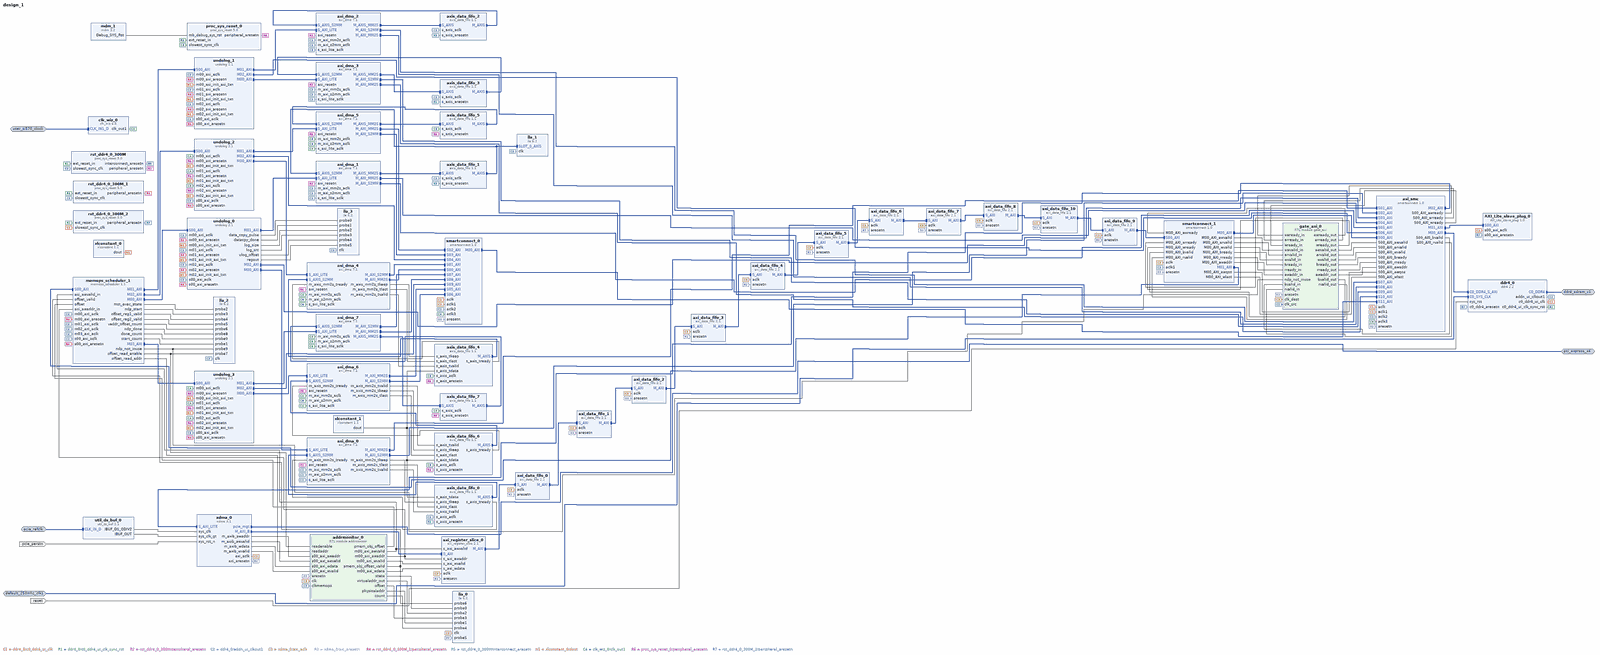
[diagram p0: block diagram of the top level, whole]
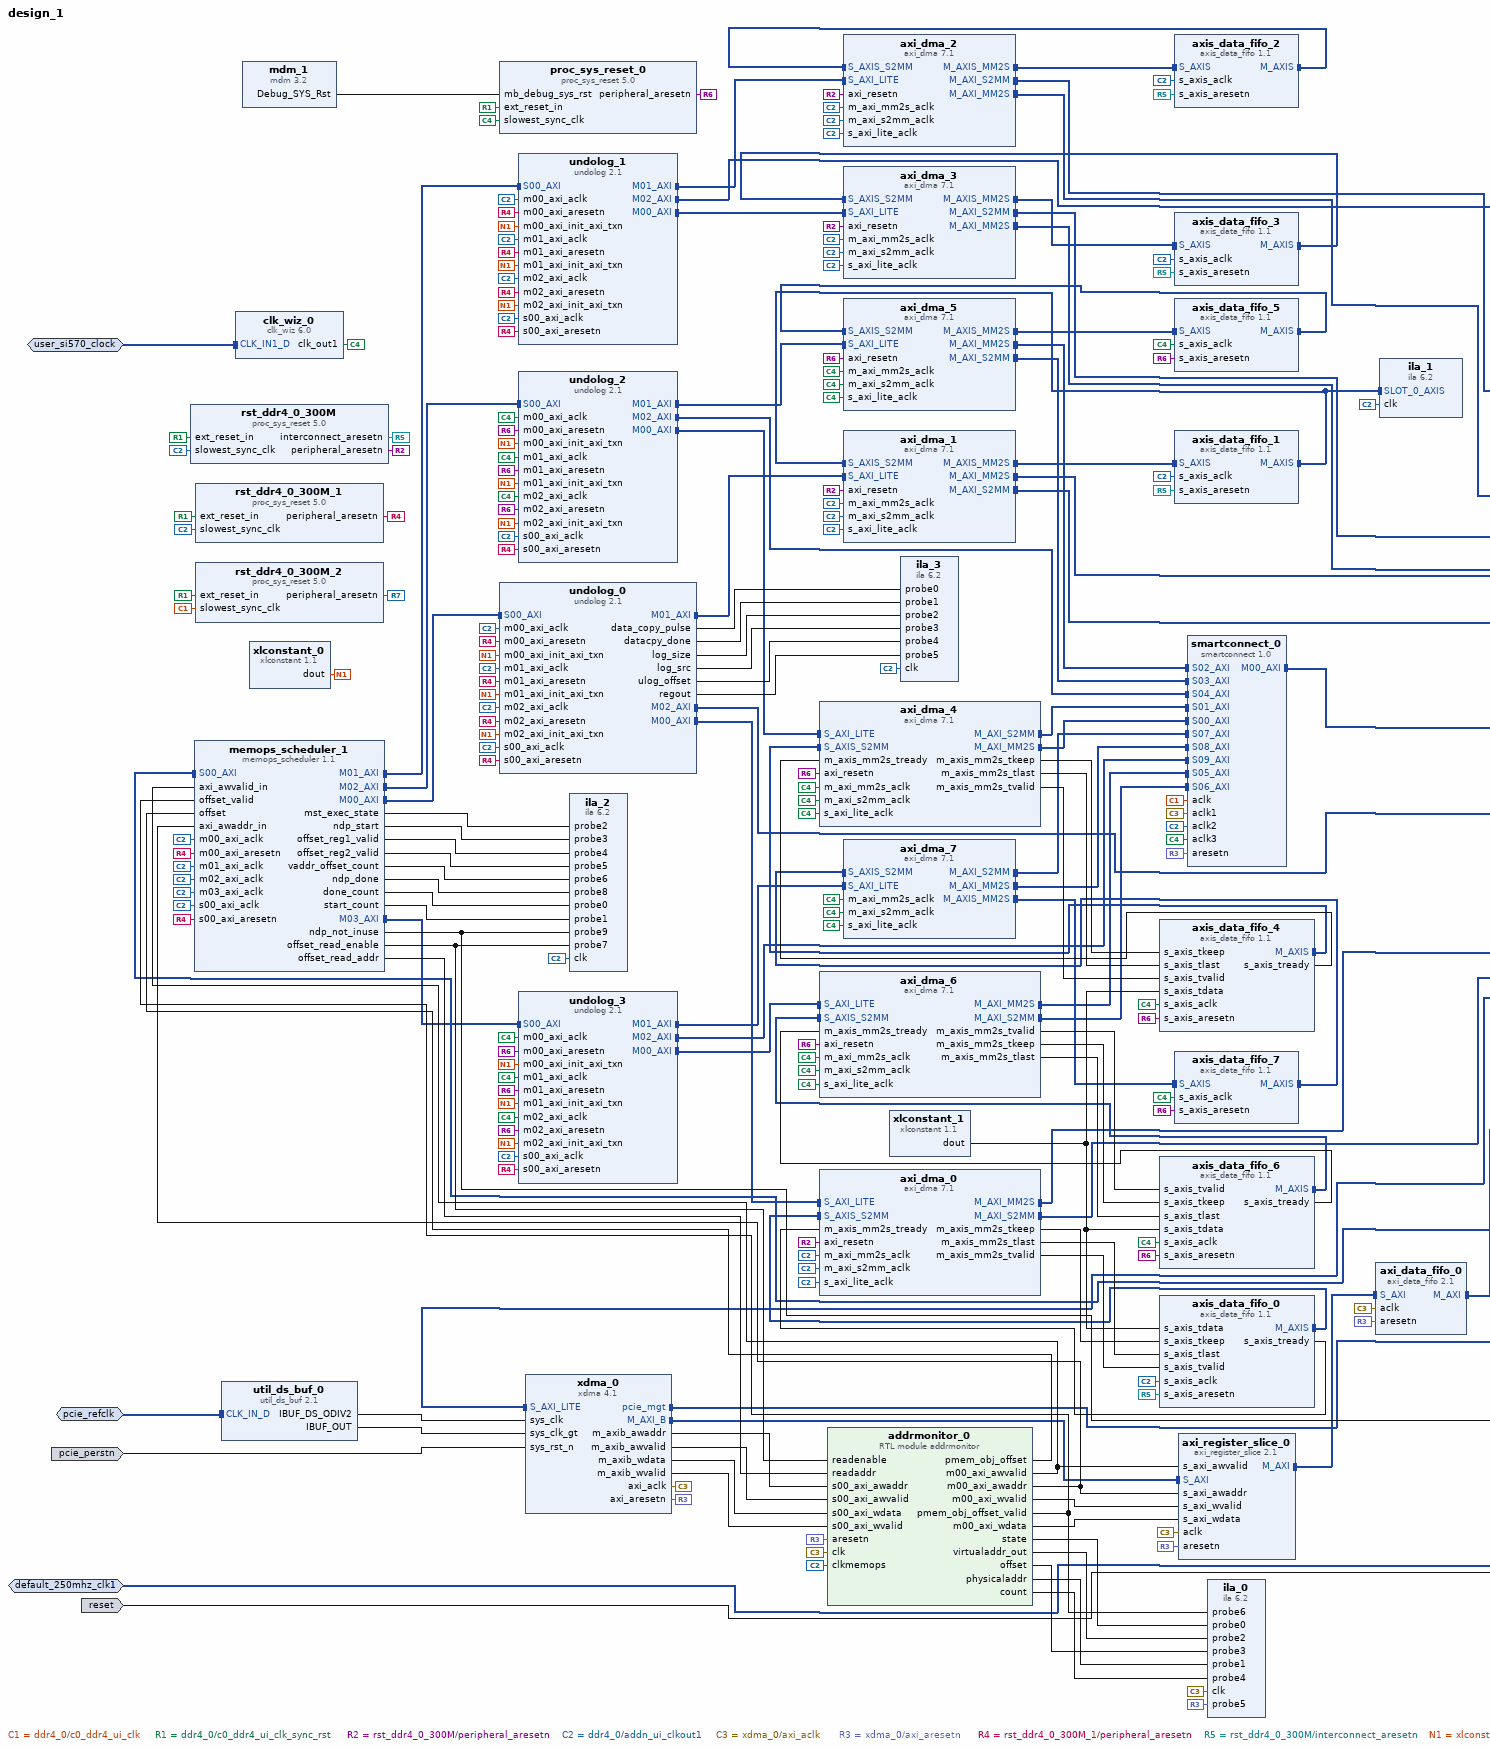
[diagram p1: block diagram of the top level, left part]
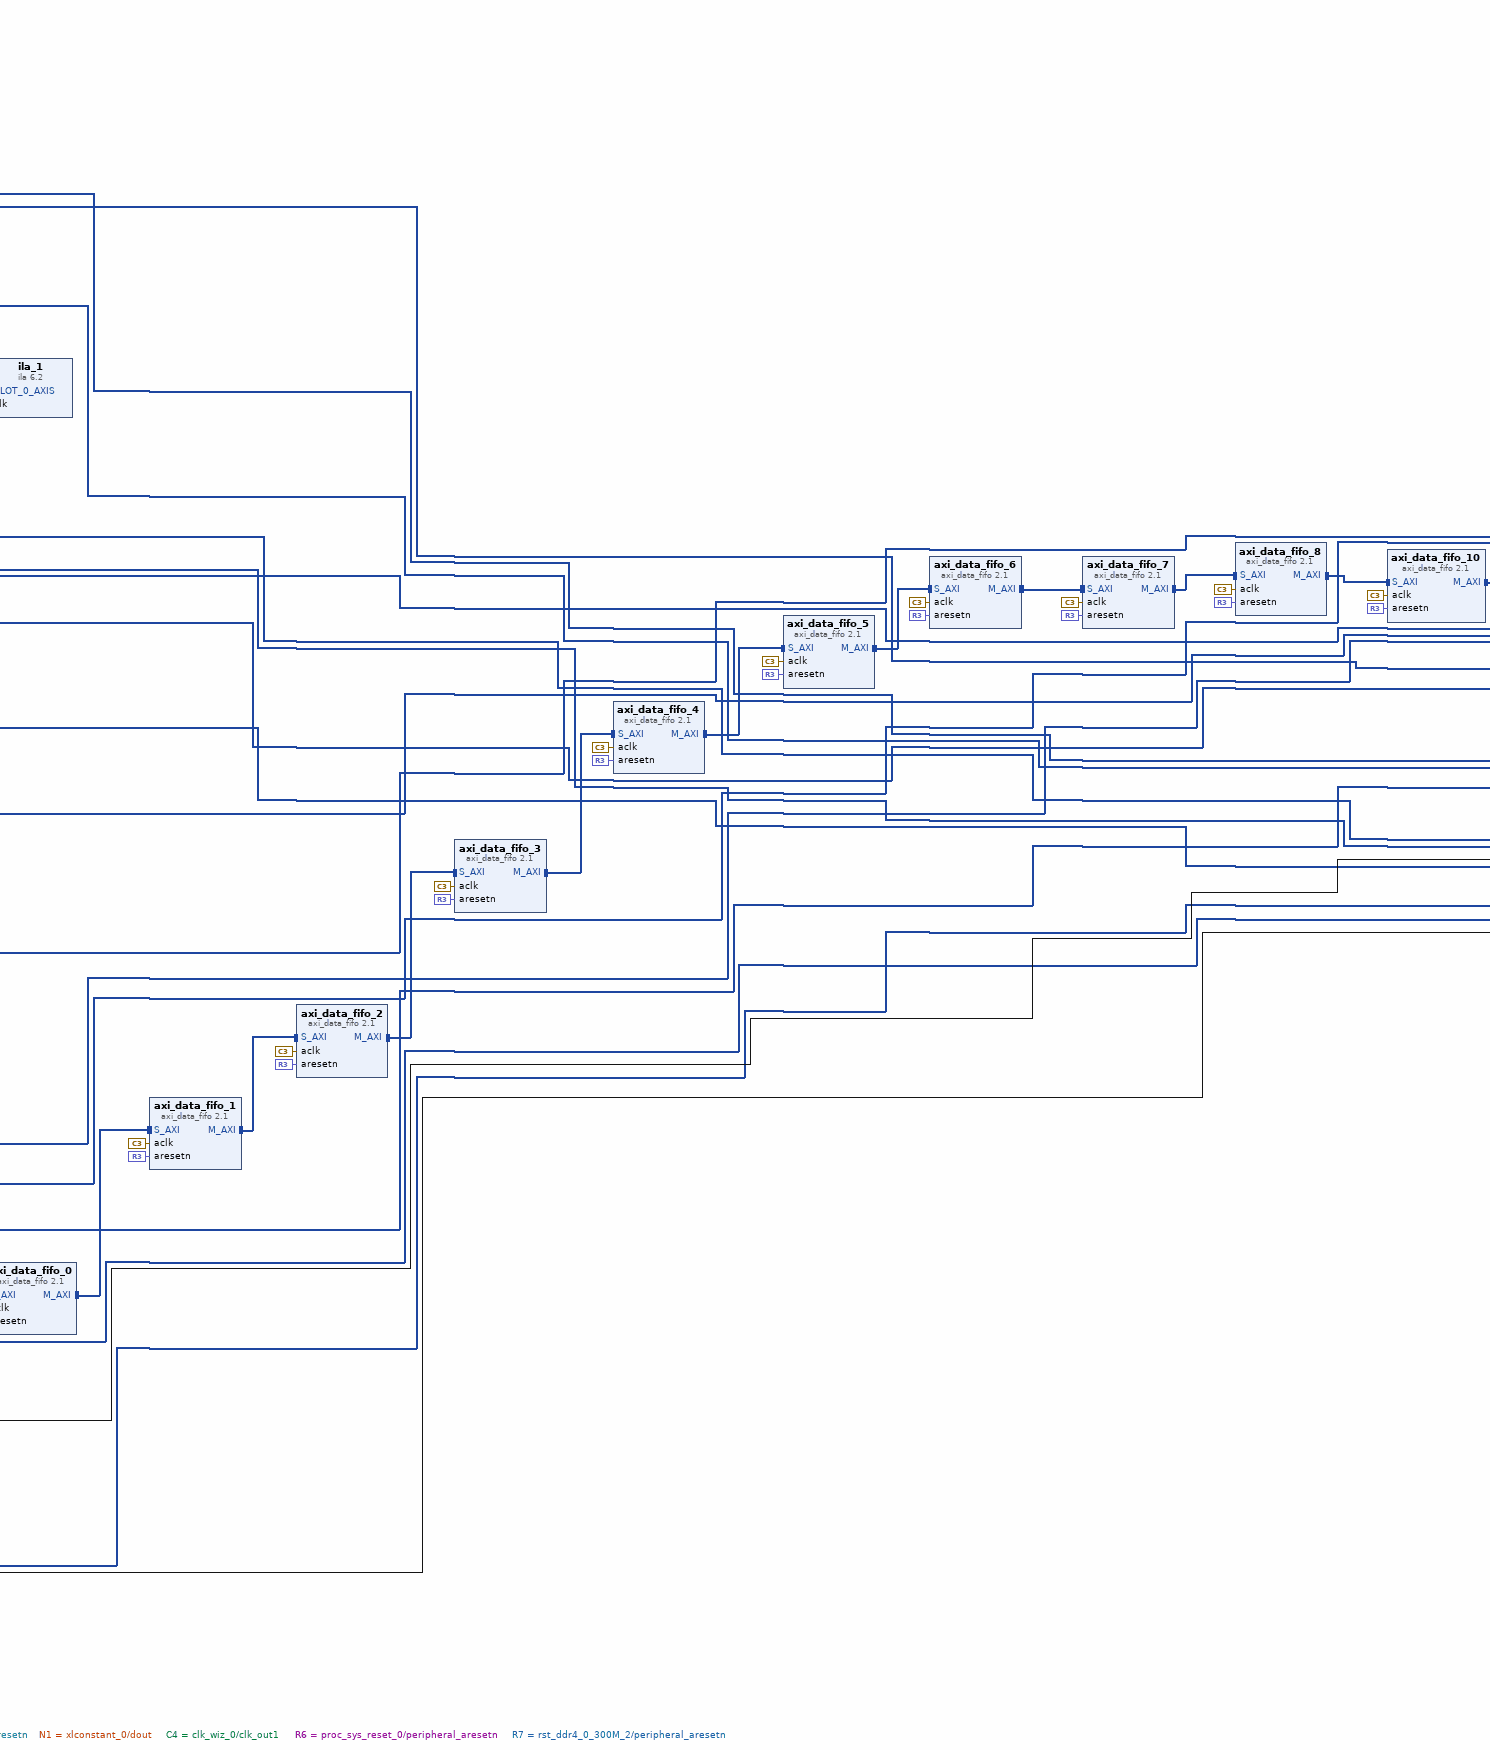
[diagram p2: block diagram of the top level, centre part]
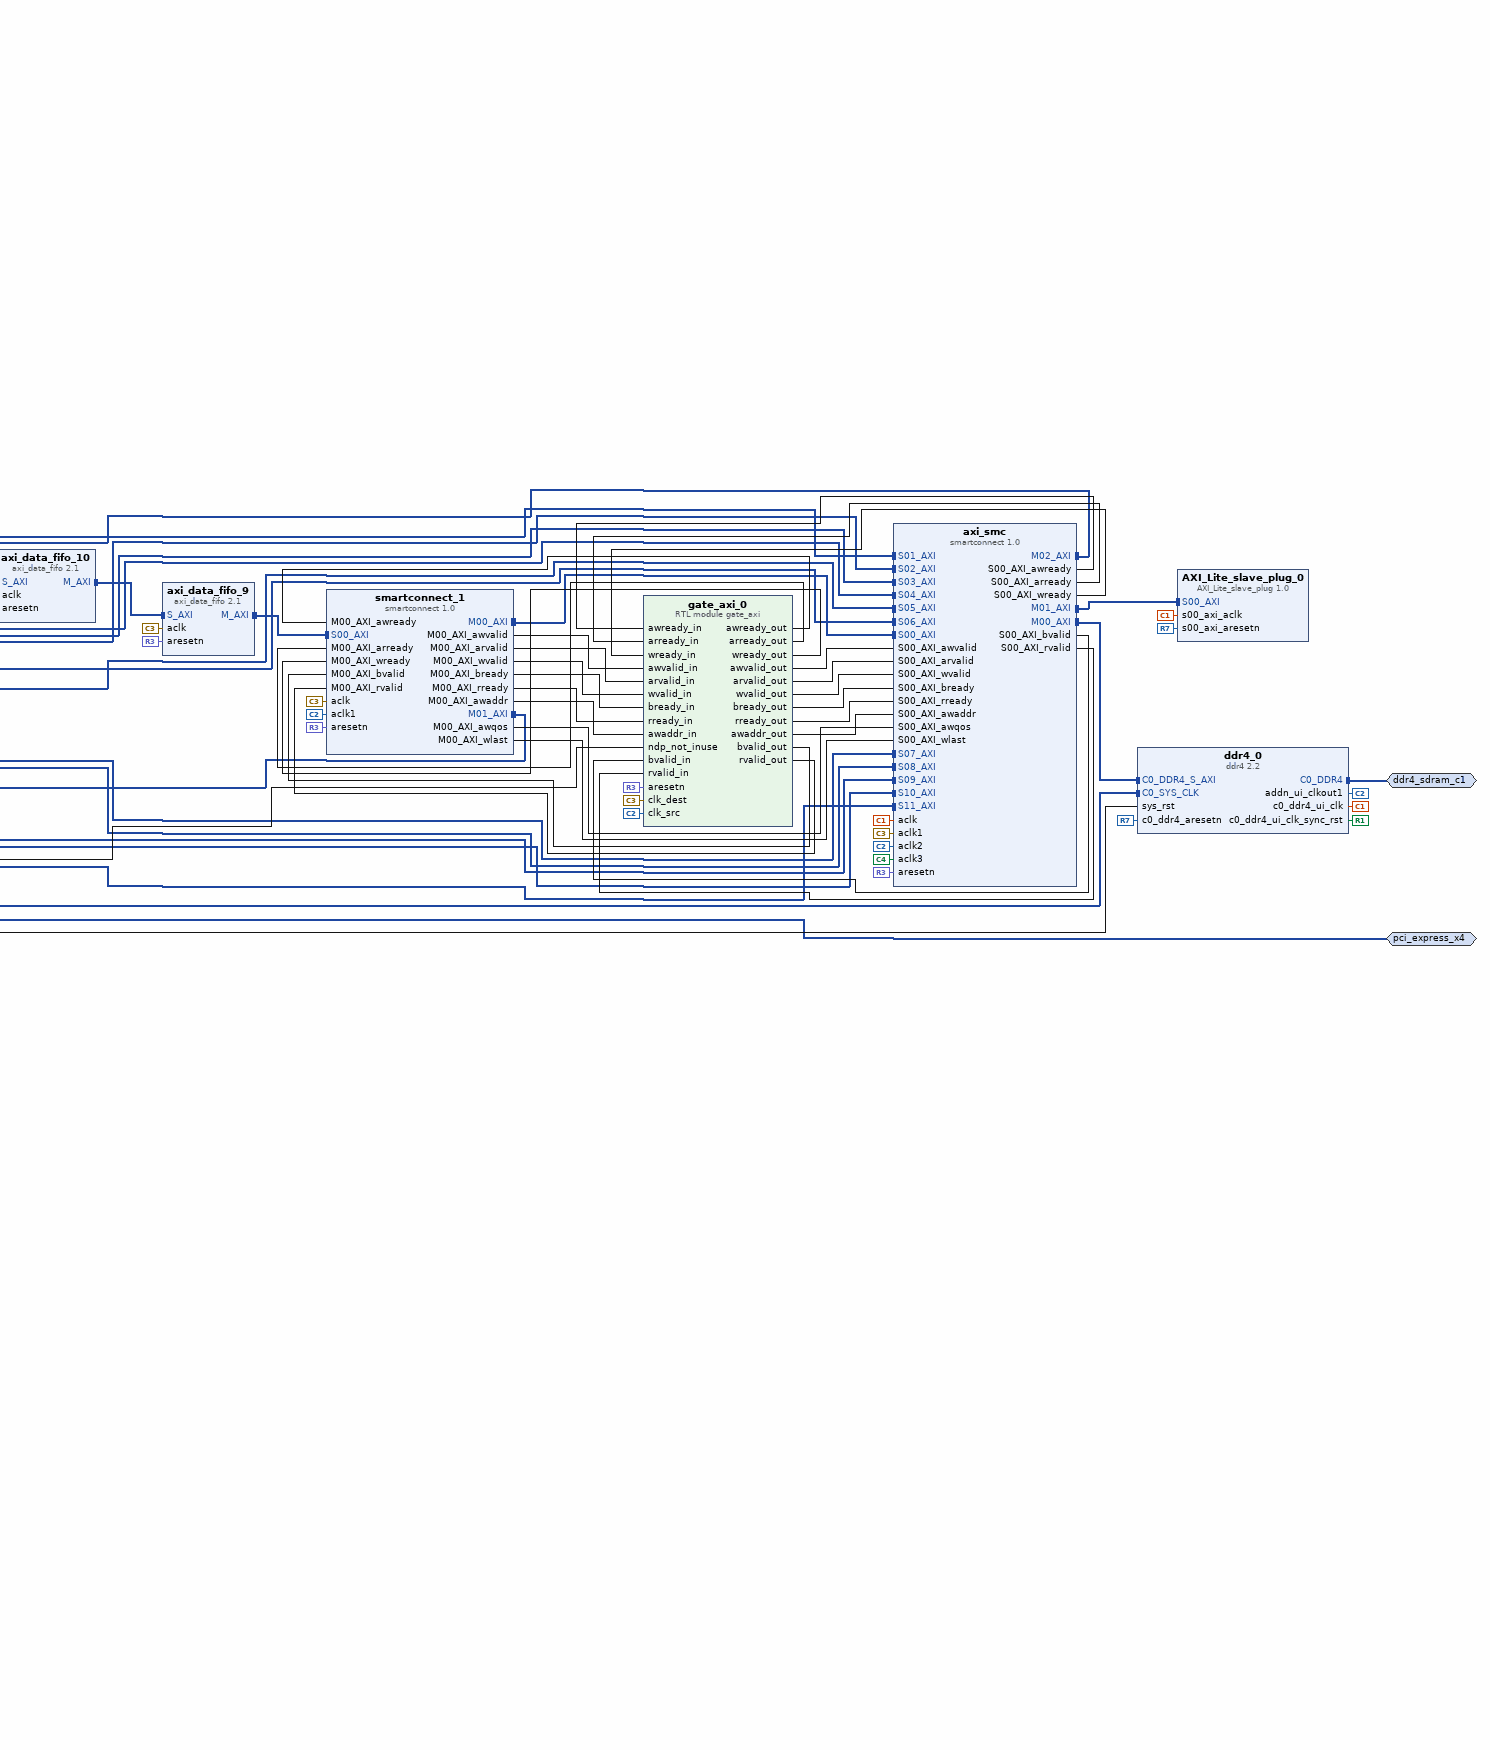
[diagram p3: block diagram of the top level, right part]
# Vivado block design design_1, xcvu9p-flga2104-2L-e, Vivado 2018.2
create_bd_design design_1

create_bd_intf_port -mode Master -vlnv xilinx.com:interface:ddr4_rtl:1.0 ddr4_sdram_c1
create_bd_intf_port -mode Slave -vlnv xilinx.com:interface:diff_clock_rtl:1.0 default_250mhz_clk1
set_property -dict {CONFIG.FREQ_HZ 250000000} [get_bd_intf_ports default_250mhz_clk1]
create_bd_intf_port -mode Master -vlnv xilinx.com:interface:pcie_7x_mgt_rtl:1.0 pci_express_x4
create_bd_intf_port -mode Slave -vlnv xilinx.com:interface:diff_clock_rtl:1.0 pcie_refclk
set_property -dict {CONFIG.FREQ_HZ 100000000} [get_bd_intf_ports pcie_refclk]
create_bd_intf_port -mode Slave -vlnv xilinx.com:interface:diff_clock_rtl:1.0 user_si570_clock
set_property -dict {CONFIG.FREQ_HZ 156250000} [get_bd_intf_ports user_si570_clock]
create_bd_port -dir I -type rst pcie_perstn
set_property -dict {CONFIG.POLARITY ACTIVE_LOW} [get_bd_ports pcie_perstn]
create_bd_port -dir I -type rst reset
set_property -dict {CONFIG.POLARITY ACTIVE_HIGH} [get_bd_ports reset]

create_bd_cell -type ip -vlnv xilinx.com:ip:ddr4:2.2 ddr4_0
set_property -dict [list \
  CONFIG.RESET_BOARD_INTERFACE reset \
  CONFIG.C0_CLOCK_BOARD_INTERFACE default_250mhz_clk1 \
  CONFIG.C0_DDR4_BOARD_INTERFACE ddr4_sdram_c1 \
  CONFIG.ADDN_UI_CLKOUT1_FREQ_HZ 250 \
  CONFIG.ADDN_UI_CLKOUT2_FREQ_HZ None \
] [get_bd_cells ddr4_0]
create_bd_cell -type ip -vlnv xilinx.com:ip:xdma:4.1 xdma_0
set_property -dict [list \
  CONFIG.functional_mode AXI_Bridge \
  CONFIG.pl_link_cap_max_link_speed 5.0_GT/s \
  CONFIG.axi_addr_width 32 \
  CONFIG.axisten_freq 250 \
  CONFIG.en_axi_slave_if false \
  CONFIG.pf0_device_id 9024 \
  CONFIG.SYS_RST_N_BOARD_INTERFACE pcie_perstn \
  CONFIG.PCIE_BOARD_INTERFACE pci_express_x4 \
  CONFIG.plltype QPLL1 \
  CONFIG.pf0_bar0_size 128 \
  CONFIG.pf0_bar0_64bit true \
  CONFIG.pf0_bar0_prefetchable true \
  CONFIG.pf0_bar2_enabled true \
  CONFIG.pf0_bar2_size 1 \
  CONFIG.pf0_bar2_scale Gigabytes \
  CONFIG.pf0_bar2_64bit true \
  CONFIG.pf0_bar2_prefetchable true \
  CONFIG.pciebar2axibar_0 0x44A10000 \
  CONFIG.pciebar2axibar_2 0x80000000 \
  CONFIG.PF0_DEVICE_ID_mqdma 9024 \
  CONFIG.PF2_DEVICE_ID_mqdma 9024 \
  CONFIG.PF3_DEVICE_ID_mqdma 9024 \
] [get_bd_cells xdma_0]
create_bd_cell -type ip -vlnv xilinx.com:ip:proc_sys_reset:5.0 rst_ddr4_0_300M
create_bd_cell -type ip -vlnv xilinx.com:ip:util_ds_buf:2.1 util_ds_buf_0
set_property -dict {CONFIG.USE_BOARD_FLOW true CONFIG.DIFF_CLK_IN_BOARD_INTERFACE pcie_refclk} [get_bd_cells util_ds_buf_0]
create_bd_cell -type ip -vlnv xilinx.com:ip:smartconnect:1.0 axi_smc
set_property -dict {CONFIG.NUM_MI 3 CONFIG.NUM_SI 15 CONFIG.NUM_CLKS 4} [get_bd_cells axi_smc]
create_bd_cell -type ip -vlnv xilinx.com:ip:proc_sys_reset:5.0 rst_ddr4_0_300M_1
create_bd_cell -type ip -vlnv xilinx.com:ip:axi_dma:7.1 axi_dma_0
set_property -dict {CONFIG.c_include_sg 0 CONFIG.c_sg_length_width 26} [get_bd_cells axi_dma_0]
create_bd_cell -type ip -vlnv xilinx.com:ip:axis_data_fifo:1.1 axis_data_fifo_0
create_bd_cell -type ip -vlnv xilinx.com:ip:proc_sys_reset:5.0 rst_ddr4_0_300M_2
create_bd_cell -type ip -vlnv xilinx.com:ip:xlconstant:1.1 xlconstant_0
create_bd_cell -type ip -vlnv xilinx.com:ip:axi_dma:7.1 axi_dma_1
set_property -dict {CONFIG.c_include_sg 0 CONFIG.c_sg_length_width 26} [get_bd_cells axi_dma_1]
create_bd_cell -type ip -vlnv xilinx.com:ip:axis_data_fifo:1.1 axis_data_fifo_1
create_bd_cell -type ip -vlnv xilinx.com:ip:xlconstant:1.1 xlconstant_1
set_property -dict {CONFIG.CONST_WIDTH 32 CONFIG.CONST_VAL 0} [get_bd_cells xlconstant_1]
create_bd_cell -type ip -vlnv xilinx.com:ip:axi_dma:7.1 axi_dma_2
set_property -dict {CONFIG.c_include_sg 0 CONFIG.c_sg_length_width 26} [get_bd_cells axi_dma_2]
create_bd_cell -type ip -vlnv xilinx.com:ip:axi_dma:7.1 axi_dma_3
set_property -dict {CONFIG.c_include_sg 0 CONFIG.c_sg_length_width 26} [get_bd_cells axi_dma_3]
create_bd_cell -type ip -vlnv xilinx.com:ip:axis_data_fifo:1.1 axis_data_fifo_2
create_bd_cell -type ip -vlnv xilinx.com:ip:axis_data_fifo:1.1 axis_data_fifo_3
create_bd_cell -type ip -vlnv xilinx.com:ip:smartconnect:1.0 smartconnect_0
set_property -dict {CONFIG.NUM_SI 10 CONFIG.NUM_CLKS 4} [get_bd_cells smartconnect_0]
create_bd_cell -type ip -vlnv xilinx.com:ip:axi_dma:7.1 axi_dma_4
set_property -dict {CONFIG.c_include_sg 0 CONFIG.c_sg_length_width 26} [get_bd_cells axi_dma_4]
create_bd_cell -type ip -vlnv xilinx.com:ip:axis_data_fifo:1.1 axis_data_fifo_4
create_bd_cell -type ip -vlnv xilinx.com:ip:axi_dma:7.1 axi_dma_5
set_property -dict {CONFIG.c_include_sg 0 CONFIG.c_sg_length_width 26} [get_bd_cells axi_dma_5]
create_bd_cell -type ip -vlnv xilinx.com:ip:axis_data_fifo:1.1 axis_data_fifo_5
create_bd_cell -type ip -vlnv xilinx.com:ip:axis_data_fifo:1.1 axis_data_fifo_6
create_bd_cell -type ip -vlnv xilinx.com:ip:axi_dma:7.1 axi_dma_6
set_property -dict {CONFIG.c_include_sg 0 CONFIG.c_sg_length_width 26} [get_bd_cells axi_dma_6]
create_bd_cell -type ip -vlnv xilinx.com:ip:axis_data_fifo:1.1 axis_data_fifo_7
create_bd_cell -type ip -vlnv xilinx.com:ip:axi_dma:7.1 axi_dma_7
set_property -dict {CONFIG.c_include_sg 0 CONFIG.c_sg_length_width 26} [get_bd_cells axi_dma_7]
create_bd_cell -type ip -vlnv xilinx.com:ip:clk_wiz:6.0 clk_wiz_0
set_property -dict [list \
  CONFIG.CLKOUT2_USED true \
  CONFIG.NUM_OUT_CLKS 2 \
  CONFIG.CLKOUT1_REQUESTED_OUT_FREQ 250 \
  CONFIG.CLKOUT1_REQUESTED_DUTY_CYCLE 50 \
  CONFIG.CLKOUT2_REQUESTED_OUT_FREQ 10 \
  CONFIG.MMCM_DIVCLK_DIVIDE 1 \
  CONFIG.MMCM_CLKFBOUT_MULT_F 8.000 \
  CONFIG.MMCM_CLKOUT0_DIVIDE_F 5.000 \
  CONFIG.MMCM_CLKOUT0_DUTY_CYCLE 0.500 \
  CONFIG.MMCM_CLKOUT1_DIVIDE 125 \
  CONFIG.USE_BOARD_FLOW true \
  CONFIG.CLK_IN1_BOARD_INTERFACE user_si570_clock \
  CONFIG.CLKOUT1_JITTER 90.547 \
  CONFIG.CLKOUT1_PHASE_ERROR 83.183 \
  CONFIG.CLKOUT2_JITTER 170.541 \
  CONFIG.CLKOUT2_PHASE_ERROR 83.183 \
] [get_bd_cells clk_wiz_0]
create_bd_cell -type ip -vlnv xilinx.com:ip:proc_sys_reset:5.0 proc_sys_reset_0
create_bd_cell -type ip -vlnv user.org:user:AXI_Lite_slave_plug:1.0 AXI_Lite_slave_plug_0
create_bd_cell -type ip -vlnv xilinx.com:ip:mdm:3.2 mdm_1
create_bd_cell -type ip -vlnv xilinx.com:ip:ila:6.2 ila_2
set_property -dict [list \
  CONFIG.C_PROBE11_WIDTH 1 \
  CONFIG.C_PROBE10_WIDTH 1 \
  CONFIG.C_PROBE9_WIDTH 1 \
  CONFIG.C_PROBE8_WIDTH 8 \
  CONFIG.C_PROBE7_WIDTH 1 \
  CONFIG.C_PROBE6_WIDTH 2 \
  CONFIG.C_PROBE5_WIDTH 1 \
  CONFIG.C_PROBE4_WIDTH 1 \
  CONFIG.C_PROBE3_WIDTH 8 \
  CONFIG.C_PROBE2_WIDTH 4 \
  CONFIG.C_PROBE1_WIDTH 5 \
  CONFIG.C_PROBE0_WIDTH 5 \
  CONFIG.C_NUM_OF_PROBES 10 \
  CONFIG.C_ENABLE_ILA_AXI_MON false \
  CONFIG.C_MONITOR_TYPE Native \
] [get_bd_cells ila_2]
create_bd_cell -type ip -vlnv xilinx.com:ip:smartconnect:1.0 smartconnect_1
set_property -dict {CONFIG.NUM_MI 2 CONFIG.NUM_SI 1 CONFIG.NUM_CLKS 2} [get_bd_cells smartconnect_1]
create_bd_cell -type ip -vlnv xilinx.com:ip:axi_register_slice:2.1 axi_register_slice_0
create_bd_cell -type ip -vlnv xilinx.com:ip:axi_data_fifo:2.1 axi_data_fifo_0
set_property -dict [list \
  CONFIG.WRITE_FIFO_DEPTH 512 \
  CONFIG.READ_FIFO_DEPTH 512 \
  CONFIG.WRITE_FIFO_DELAY 1 \
  CONFIG.READ_FIFO_DELAY 1 \
] [get_bd_cells axi_data_fifo_0]
create_bd_cell -type ip -vlnv xilinx.com:ip:axi_data_fifo:2.1 axi_data_fifo_1
set_property -dict [list \
  CONFIG.WRITE_FIFO_DEPTH 512 \
  CONFIG.READ_FIFO_DEPTH 512 \
  CONFIG.WRITE_FIFO_DELAY 1 \
  CONFIG.READ_FIFO_DELAY 1 \
] [get_bd_cells axi_data_fifo_1]
create_bd_cell -type ip -vlnv xilinx.com:ip:axi_data_fifo:2.1 axi_data_fifo_2
set_property -dict [list \
  CONFIG.WRITE_FIFO_DEPTH 512 \
  CONFIG.READ_FIFO_DEPTH 512 \
  CONFIG.WRITE_FIFO_DELAY 1 \
  CONFIG.READ_FIFO_DELAY 1 \
] [get_bd_cells axi_data_fifo_2]
create_bd_cell -type ip -vlnv xilinx.com:ip:axi_data_fifo:2.1 axi_data_fifo_3
set_property -dict [list \
  CONFIG.WRITE_FIFO_DEPTH 512 \
  CONFIG.READ_FIFO_DEPTH 512 \
  CONFIG.WRITE_FIFO_DELAY 1 \
  CONFIG.READ_FIFO_DELAY 1 \
] [get_bd_cells axi_data_fifo_3]
create_bd_cell -type ip -vlnv xilinx.com:ip:axi_data_fifo:2.1 axi_data_fifo_4
set_property -dict [list \
  CONFIG.WRITE_FIFO_DEPTH 512 \
  CONFIG.READ_FIFO_DEPTH 512 \
  CONFIG.WRITE_FIFO_DELAY 1 \
  CONFIG.READ_FIFO_DELAY 1 \
] [get_bd_cells axi_data_fifo_4]
create_bd_cell -type ip -vlnv xilinx.com:ip:axi_data_fifo:2.1 axi_data_fifo_5
set_property -dict [list \
  CONFIG.WRITE_FIFO_DEPTH 512 \
  CONFIG.READ_FIFO_DEPTH 512 \
  CONFIG.WRITE_FIFO_DELAY 1 \
  CONFIG.READ_FIFO_DELAY 1 \
] [get_bd_cells axi_data_fifo_5]
create_bd_cell -type ip -vlnv xilinx.com:ip:axi_data_fifo:2.1 axi_data_fifo_6
set_property -dict [list \
  CONFIG.WRITE_FIFO_DEPTH 512 \
  CONFIG.READ_FIFO_DEPTH 512 \
  CONFIG.WRITE_FIFO_DELAY 1 \
  CONFIG.READ_FIFO_DELAY 1 \
] [get_bd_cells axi_data_fifo_6]
create_bd_cell -type ip -vlnv xilinx.com:ip:axi_data_fifo:2.1 axi_data_fifo_7
set_property -dict [list \
  CONFIG.WRITE_FIFO_DEPTH 512 \
  CONFIG.READ_FIFO_DEPTH 512 \
  CONFIG.WRITE_FIFO_DELAY 1 \
  CONFIG.READ_FIFO_DELAY 1 \
] [get_bd_cells axi_data_fifo_7]
create_bd_cell -type ip -vlnv xilinx.com:ip:axi_data_fifo:2.1 axi_data_fifo_8
set_property -dict [list \
  CONFIG.WRITE_FIFO_DEPTH 512 \
  CONFIG.READ_FIFO_DEPTH 512 \
  CONFIG.WRITE_FIFO_DELAY 1 \
  CONFIG.READ_FIFO_DELAY 1 \
] [get_bd_cells axi_data_fifo_8]
create_bd_cell -type ip -vlnv xilinx.com:ip:axi_data_fifo:2.1 axi_data_fifo_9
set_property -dict [list \
  CONFIG.WRITE_FIFO_DEPTH 512 \
  CONFIG.READ_FIFO_DEPTH 512 \
  CONFIG.WRITE_FIFO_DELAY 1 \
  CONFIG.READ_FIFO_DELAY 1 \
] [get_bd_cells axi_data_fifo_9]
create_bd_cell -type ip -vlnv xilinx.com:ip:axi_data_fifo:2.1 axi_data_fifo_10
set_property -dict [list \
  CONFIG.WRITE_FIFO_DEPTH 512 \
  CONFIG.READ_FIFO_DEPTH 512 \
  CONFIG.WRITE_FIFO_DELAY 1 \
  CONFIG.READ_FIFO_DELAY 1 \
] [get_bd_cells axi_data_fifo_10]
create_bd_cell -type module -reference gate_axi gate_axi_0
create_bd_cell -type ip -vlnv xilinx.com:ip:ila:6.2 ila_3
set_property -dict [list \
  CONFIG.C_PROBE5_WIDTH 32 \
  CONFIG.C_PROBE4_WIDTH 64 \
  CONFIG.C_PROBE3_WIDTH 64 \
  CONFIG.C_PROBE2_WIDTH 64 \
  CONFIG.C_NUM_OF_PROBES 6 \
  CONFIG.C_ENABLE_ILA_AXI_MON false \
  CONFIG.C_MONITOR_TYPE Native \
] [get_bd_cells ila_3]
create_bd_cell -type ip -vlnv xilinx.com:ip:ila:6.2 ila_0
set_property -dict [list \
  CONFIG.C_PROBE5_WIDTH 1 \
  CONFIG.C_PROBE4_WIDTH 6 \
  CONFIG.C_PROBE3_WIDTH 64 \
  CONFIG.C_PROBE2_WIDTH 64 \
  CONFIG.C_PROBE1_WIDTH 32 \
  CONFIG.C_PROBE0_WIDTH 3 \
  CONFIG.C_NUM_OF_PROBES 7 \
  CONFIG.C_ENABLE_ILA_AXI_MON false \
  CONFIG.C_MONITOR_TYPE Native \
] [get_bd_cells ila_0]
create_bd_cell -type module -reference addrmonitor addrmonitor_0
create_bd_cell -type ip -vlnv xilinx.com:ip:ila:6.2 ila_1
set_property -dict {CONFIG.C_NUM_OF_PROBES 9 CONFIG.C_SLOT_0_AXI_PROTOCOL AXI4S} [get_bd_cells ila_1]
create_bd_cell -type ip -vlnv user.org:user:undolog:2.1 undolog_0
set_property -dict [list \
  CONFIG.C_M01_AXI_START_DATA_VALUE 0x00000000 \
  CONFIG.C_M01_AXI_TARGET_SLAVE_BASE_ADDR 0x40000000 \
  CONFIG.C_M02_AXI_START_DATA_VALUE 0x00000000 \
  CONFIG.C_M02_AXI_TARGET_SLAVE_BASE_ADDR 0x00000000 \
  CONFIG.C_M00_AXI_START_DATA_VALUE 0x00000000 \
  CONFIG.C_M00_AXI_TARGET_SLAVE_BASE_ADDR 0x40000000 \
] [get_bd_cells undolog_0]
create_bd_cell -type ip -vlnv user.org:user:undolog:2.1 undolog_1
set_property -dict [list \
  CONFIG.C_M01_AXI_START_DATA_VALUE 0x00000000 \
  CONFIG.C_M02_AXI_START_DATA_VALUE 0x00000000 \
  CONFIG.C_M02_AXI_TARGET_SLAVE_BASE_ADDR 0x00000000 \
  CONFIG.C_M00_AXI_START_DATA_VALUE 0x00000000 \
] [get_bd_cells undolog_1]
create_bd_cell -type ip -vlnv user.org:user:undolog:2.1 undolog_2
set_property -dict [list \
  CONFIG.C_M01_AXI_START_DATA_VALUE 0x00000000 \
  CONFIG.C_M02_AXI_START_DATA_VALUE 0x00000000 \
  CONFIG.C_M02_AXI_TARGET_SLAVE_BASE_ADDR 0x00000000 \
  CONFIG.C_M00_AXI_START_DATA_VALUE 0x00000000 \
] [get_bd_cells undolog_2]
create_bd_cell -type ip -vlnv user.org:user:undolog:2.1 undolog_3
set_property -dict [list \
  CONFIG.C_M01_AXI_START_DATA_VALUE 0x00000000 \
  CONFIG.C_M02_AXI_START_DATA_VALUE 0x00000000 \
  CONFIG.C_M02_AXI_TARGET_SLAVE_BASE_ADDR 0x00000000 \
  CONFIG.C_M00_AXI_START_DATA_VALUE 0x00000000 \
] [get_bd_cells undolog_3]
create_bd_cell -type ip -vlnv user.org:user:memops_scheduler:1.1 memops_scheduler_1

# ---- connections ----

connect_bd_intf_net [get_bd_intf_pins axi_smc/M02_AXI] [get_bd_intf_pins xdma_0/S_AXI_LITE]
connect_bd_intf_net [get_bd_intf_pins axi_smc/M01_AXI] [get_bd_intf_pins AXI_Lite_slave_plug_0/S00_AXI]
connect_bd_intf_net [get_bd_intf_pins axi_dma_0/M_AXI_MM2S] [get_bd_intf_pins axi_smc/S01_AXI]
connect_bd_intf_net [get_bd_intf_pins axi_dma_0/M_AXI_S2MM] [get_bd_intf_pins axi_smc/S02_AXI]
connect_bd_intf_net [get_bd_intf_pins axis_data_fifo_0/M_AXIS] [get_bd_intf_pins axi_dma_0/S_AXIS_S2MM]
connect_bd_intf_net [get_bd_intf_pins axi_smc/S03_AXI] [get_bd_intf_pins undolog_0/M02_AXI]
connect_bd_intf_net [get_bd_intf_pins undolog_0/M00_AXI] [get_bd_intf_pins axi_dma_0/S_AXI_LITE]
connect_bd_intf_net [get_bd_intf_pins undolog_0/M01_AXI] [get_bd_intf_pins axi_dma_1/S_AXI_LITE]
connect_bd_intf_net [get_bd_intf_pins axi_dma_1/M_AXI_MM2S] [get_bd_intf_pins axi_smc/S04_AXI]
connect_bd_intf_net [get_bd_intf_pins axi_dma_1/M_AXI_S2MM] [get_bd_intf_pins axi_smc/S05_AXI]
connect_bd_intf_net [get_bd_intf_pins axis_data_fifo_1/S_AXIS] [get_bd_intf_pins axi_dma_1/M_AXIS_MM2S]
connect_bd_intf_net [get_bd_intf_pins axis_data_fifo_1/M_AXIS] [get_bd_intf_pins axi_dma_1/S_AXIS_S2MM]
connect_bd_intf_net [get_bd_intf_pins axis_data_fifo_1/M_AXIS] [get_bd_intf_pins ila_1/SLOT_0_AXIS]
connect_bd_intf_net [get_bd_intf_pins axi_smc/S06_AXI] [get_bd_intf_pins undolog_1/M02_AXI]
connect_bd_intf_net [get_bd_intf_pins axis_data_fifo_2/M_AXIS] [get_bd_intf_pins axi_dma_2/S_AXIS_S2MM]
connect_bd_intf_net [get_bd_intf_pins axis_data_fifo_2/S_AXIS] [get_bd_intf_pins axi_dma_2/M_AXIS_MM2S]
connect_bd_intf_net [get_bd_intf_pins axi_dma_2/M_AXI_S2MM] [get_bd_intf_pins axi_smc/S07_AXI]
connect_bd_intf_net [get_bd_intf_pins axi_smc/S08_AXI] [get_bd_intf_pins axi_dma_2/M_AXI_MM2S]
connect_bd_intf_net [get_bd_intf_pins axi_dma_3/M_AXI_S2MM] [get_bd_intf_pins axi_smc/S09_AXI]
connect_bd_intf_net [get_bd_intf_pins axi_dma_3/M_AXI_MM2S] [get_bd_intf_pins axi_smc/S10_AXI]
connect_bd_intf_net [get_bd_intf_pins axi_dma_3/M_AXIS_MM2S] [get_bd_intf_pins axis_data_fifo_3/S_AXIS]
connect_bd_intf_net [get_bd_intf_pins axis_data_fifo_3/M_AXIS] [get_bd_intf_pins axi_dma_3/S_AXIS_S2MM]
connect_bd_intf_net [get_bd_intf_pins undolog_1/M00_AXI] [get_bd_intf_pins axi_dma_3/S_AXI_LITE]
connect_bd_intf_net [get_bd_intf_pins axi_dma_2/S_AXI_LITE] [get_bd_intf_pins undolog_1/M01_AXI]
connect_bd_intf_net [get_bd_intf_pins smartconnect_0/M00_AXI] [get_bd_intf_pins axi_smc/S11_AXI]
connect_bd_intf_net [get_bd_intf_pins undolog_2/M00_AXI] [get_bd_intf_pins axi_dma_4/S_AXI_LITE]
connect_bd_intf_net [get_bd_intf_pins axi_dma_4/S_AXIS_S2MM] [get_bd_intf_pins axis_data_fifo_4/M_AXIS]
connect_bd_intf_net [get_bd_intf_pins axi_dma_4/M_AXI_S2MM] [get_bd_intf_pins smartconnect_0/S01_AXI]
connect_bd_intf_net [get_bd_intf_pins axi_dma_4/M_AXI_MM2S] [get_bd_intf_pins smartconnect_0/S00_AXI]
connect_bd_intf_net [get_bd_intf_pins undolog_2/M01_AXI] [get_bd_intf_pins axi_dma_5/S_AXI_LITE]
connect_bd_intf_net [get_bd_intf_pins axis_data_fifo_5/M_AXIS] [get_bd_intf_pins axi_dma_5/S_AXIS_S2MM]
connect_bd_intf_net [get_bd_intf_pins axis_data_fifo_5/S_AXIS] [get_bd_intf_pins axi_dma_5/M_AXIS_MM2S]
connect_bd_intf_net [get_bd_intf_pins smartconnect_0/S02_AXI] [get_bd_intf_pins axi_dma_5/M_AXI_MM2S]
connect_bd_intf_net [get_bd_intf_pins axi_dma_5/M_AXI_S2MM] [get_bd_intf_pins smartconnect_0/S03_AXI]
connect_bd_intf_net [get_bd_intf_pins undolog_2/M02_AXI] [get_bd_intf_pins smartconnect_0/S04_AXI]
connect_bd_intf_net [get_bd_intf_pins axis_data_fifo_6/M_AXIS] [get_bd_intf_pins axi_dma_6/S_AXIS_S2MM]
connect_bd_intf_net [get_bd_intf_pins undolog_3/M00_AXI] [get_bd_intf_pins axi_dma_6/S_AXI_LITE]
connect_bd_intf_net [get_bd_intf_pins smartconnect_0/S05_AXI] [get_bd_intf_pins axi_dma_6/M_AXI_MM2S]
connect_bd_intf_net [get_bd_intf_pins axi_dma_6/M_AXI_S2MM] [get_bd_intf_pins smartconnect_0/S06_AXI]
connect_bd_intf_net [get_bd_intf_pins axis_data_fifo_7/M_AXIS] [get_bd_intf_pins axi_dma_7/S_AXIS_S2MM]
connect_bd_intf_net [get_bd_intf_pins axi_dma_7/M_AXIS_MM2S] [get_bd_intf_pins axis_data_fifo_7/S_AXIS]
connect_bd_intf_net [get_bd_intf_pins undolog_3/M01_AXI] [get_bd_intf_pins axi_dma_7/S_AXI_LITE]
connect_bd_intf_net [get_bd_intf_pins axi_dma_7/M_AXI_S2MM] [get_bd_intf_pins smartconnect_0/S07_AXI]
connect_bd_intf_net [get_bd_intf_pins smartconnect_0/S08_AXI] [get_bd_intf_pins axi_dma_7/M_AXI_MM2S]
connect_bd_intf_net [get_bd_intf_pins undolog_3/M02_AXI] [get_bd_intf_pins smartconnect_0/S09_AXI]
connect_bd_intf_net [get_bd_intf_pins axi_smc/M00_AXI] [get_bd_intf_pins ddr4_0/C0_DDR4_S_AXI]
connect_bd_intf_net [get_bd_intf_pins smartconnect_1/M00_AXI] [get_bd_intf_pins axi_smc/S00_AXI]
connect_bd_intf_net [get_bd_intf_pins memops_scheduler_1/S00_AXI] [get_bd_intf_pins smartconnect_1/M01_AXI]
connect_bd_intf_net [get_bd_intf_pins memops_scheduler_1/M00_AXI] [get_bd_intf_pins undolog_0/S00_AXI]
connect_bd_intf_net [get_bd_intf_pins memops_scheduler_1/M01_AXI] [get_bd_intf_pins undolog_1/S00_AXI]
connect_bd_intf_net [get_bd_intf_pins memops_scheduler_1/M02_AXI] [get_bd_intf_pins undolog_2/S00_AXI]
connect_bd_intf_net [get_bd_intf_pins memops_scheduler_1/M03_AXI] [get_bd_intf_pins undolog_3/S00_AXI]
connect_bd_intf_net [get_bd_intf_pins xdma_0/M_AXI_B] [get_bd_intf_pins axi_register_slice_0/S_AXI]
connect_bd_intf_net [get_bd_intf_pins axi_register_slice_0/M_AXI] [get_bd_intf_pins axi_data_fifo_0/S_AXI]
connect_bd_intf_net [get_bd_intf_pins axi_data_fifo_0/M_AXI] [get_bd_intf_pins axi_data_fifo_1/S_AXI]
connect_bd_intf_net [get_bd_intf_pins axi_data_fifo_1/M_AXI] [get_bd_intf_pins axi_data_fifo_2/S_AXI]
connect_bd_intf_net [get_bd_intf_pins axi_data_fifo_2/M_AXI] [get_bd_intf_pins axi_data_fifo_3/S_AXI]
connect_bd_intf_net [get_bd_intf_pins axi_data_fifo_3/M_AXI] [get_bd_intf_pins axi_data_fifo_4/S_AXI]
connect_bd_intf_net [get_bd_intf_pins axi_data_fifo_4/M_AXI] [get_bd_intf_pins axi_data_fifo_5/S_AXI]
connect_bd_intf_net [get_bd_intf_pins axi_data_fifo_5/M_AXI] [get_bd_intf_pins axi_data_fifo_6/S_AXI]
connect_bd_intf_net [get_bd_intf_pins axi_data_fifo_6/M_AXI] [get_bd_intf_pins axi_data_fifo_7/S_AXI]
connect_bd_intf_net [get_bd_intf_pins axi_data_fifo_7/M_AXI] [get_bd_intf_pins axi_data_fifo_8/S_AXI]
connect_bd_intf_net [get_bd_intf_pins axi_data_fifo_8/M_AXI] [get_bd_intf_pins axi_data_fifo_10/S_AXI]
connect_bd_intf_net [get_bd_intf_pins axi_data_fifo_10/M_AXI] [get_bd_intf_pins axi_data_fifo_9/S_AXI]
connect_bd_intf_net [get_bd_intf_pins axi_data_fifo_9/M_AXI] [get_bd_intf_pins smartconnect_1/S00_AXI]
connect_bd_intf_net [get_bd_intf_ports ddr4_sdram_c1] [get_bd_intf_pins ddr4_0/C0_DDR4]
connect_bd_intf_net -intf_net default_250mhz_clk1_1 [get_bd_intf_ports default_250mhz_clk1] [get_bd_intf_pins ddr4_0/C0_SYS_CLK]
connect_bd_intf_net [get_bd_intf_ports pci_express_x4] [get_bd_intf_pins xdma_0/pcie_mgt]
connect_bd_intf_net [get_bd_intf_ports pcie_refclk] [get_bd_intf_pins util_ds_buf_0/CLK_IN_D]
connect_bd_intf_net [get_bd_intf_ports user_si570_clock] [get_bd_intf_pins clk_wiz_0/CLK_IN1_D]
connect_bd_net [get_bd_ports pcie_perstn] [get_bd_pins xdma_0/sys_rst_n]
connect_bd_net [get_bd_pins ddr4_0/c0_ddr4_ui_clk] \
  [get_bd_pins axi_smc/aclk] [get_bd_pins rst_ddr4_0_300M_2/slowest_sync_clk] [get_bd_pins smartconnect_0/aclk] \
  [get_bd_pins AXI_Lite_slave_plug_0/s00_axi_aclk]
connect_bd_net [get_bd_pins ddr4_0/c0_ddr4_ui_clk_sync_rst] \
  [get_bd_pins rst_ddr4_0_300M/ext_reset_in] [get_bd_pins rst_ddr4_0_300M_1/ext_reset_in] \
  [get_bd_pins rst_ddr4_0_300M_2/ext_reset_in] [get_bd_pins proc_sys_reset_0/ext_reset_in]
connect_bd_net [get_bd_pins rst_ddr4_0_300M/peripheral_aresetn] \
  [get_bd_pins axi_dma_3/axi_resetn] [get_bd_pins axi_dma_2/axi_resetn] [get_bd_pins axi_dma_1/axi_resetn] \
  [get_bd_pins axi_dma_0/axi_resetn]
connect_bd_net [get_bd_ports reset] [get_bd_pins ddr4_0/sys_rst]
connect_bd_net [get_bd_pins ddr4_0/addn_ui_clkout1] \
  [get_bd_pins axi_smc/aclk2] [get_bd_pins axi_dma_0/s_axi_lite_aclk] [get_bd_pins axi_dma_0/m_axi_mm2s_aclk] \
  [get_bd_pins axi_dma_0/m_axi_s2mm_aclk] [get_bd_pins axis_data_fifo_0/s_axis_aclk] [get_bd_pins axi_dma_1/s_axi_lite_aclk] \
  [get_bd_pins axi_dma_1/m_axi_mm2s_aclk] [get_bd_pins axi_dma_1/m_axi_s2mm_aclk] [get_bd_pins axis_data_fifo_1/s_axis_aclk] \
  [get_bd_pins axi_dma_2/s_axi_lite_aclk] [get_bd_pins axi_dma_2/m_axi_mm2s_aclk] [get_bd_pins axi_dma_2/m_axi_s2mm_aclk] \
  [get_bd_pins axi_dma_3/m_axi_s2mm_aclk] [get_bd_pins axi_dma_3/m_axi_mm2s_aclk] [get_bd_pins axi_dma_3/s_axi_lite_aclk] \
  [get_bd_pins axis_data_fifo_2/s_axis_aclk] [get_bd_pins axis_data_fifo_3/s_axis_aclk] \
  [get_bd_pins rst_ddr4_0_300M_1/slowest_sync_clk] [get_bd_pins rst_ddr4_0_300M/slowest_sync_clk] \
  [get_bd_pins smartconnect_0/aclk2] [get_bd_pins ila_2/clk] [get_bd_pins smartconnect_1/aclk1] \
  [get_bd_pins gate_axi_0/clk_src] [get_bd_pins ila_3/clk] [get_bd_pins addrmonitor_0/clkmemops] [get_bd_pins ila_1/clk] \
  [get_bd_pins undolog_0/m01_axi_aclk] [get_bd_pins undolog_0/m02_axi_aclk] [get_bd_pins undolog_0/s00_axi_aclk] \
  [get_bd_pins undolog_0/m00_axi_aclk] [get_bd_pins undolog_1/m01_axi_aclk] [get_bd_pins undolog_1/m02_axi_aclk] \
  [get_bd_pins undolog_1/s00_axi_aclk] [get_bd_pins undolog_1/m00_axi_aclk] [get_bd_pins undolog_2/s00_axi_aclk] \
  [get_bd_pins undolog_3/s00_axi_aclk] [get_bd_pins memops_scheduler_1/m03_axi_aclk] \
  [get_bd_pins memops_scheduler_1/m01_axi_aclk] [get_bd_pins memops_scheduler_1/m00_axi_aclk] \
  [get_bd_pins memops_scheduler_1/m02_axi_aclk] [get_bd_pins memops_scheduler_1/s00_axi_aclk]
connect_bd_net [get_bd_pins util_ds_buf_0/IBUF_DS_ODIV2] [get_bd_pins xdma_0/sys_clk]
connect_bd_net [get_bd_pins util_ds_buf_0/IBUF_OUT] [get_bd_pins xdma_0/sys_clk_gt]
connect_bd_net [get_bd_pins xdma_0/axi_aclk] \
  [get_bd_pins axi_smc/aclk1] [get_bd_pins smartconnect_0/aclk1] [get_bd_pins smartconnect_1/aclk] \
  [get_bd_pins axi_register_slice_0/aclk] [get_bd_pins axi_data_fifo_0/aclk] [get_bd_pins axi_data_fifo_1/aclk] \
  [get_bd_pins axi_data_fifo_2/aclk] [get_bd_pins axi_data_fifo_3/aclk] [get_bd_pins axi_data_fifo_4/aclk] \
  [get_bd_pins axi_data_fifo_5/aclk] [get_bd_pins axi_data_fifo_6/aclk] [get_bd_pins axi_data_fifo_7/aclk] \
  [get_bd_pins axi_data_fifo_8/aclk] [get_bd_pins axi_data_fifo_10/aclk] [get_bd_pins axi_data_fifo_9/aclk] \
  [get_bd_pins gate_axi_0/clk_dest] [get_bd_pins ila_0/clk] [get_bd_pins addrmonitor_0/clk]
connect_bd_net [get_bd_pins xdma_0/axi_aresetn] \
  [get_bd_pins axi_smc/aresetn] [get_bd_pins smartconnect_0/aresetn] [get_bd_pins smartconnect_1/aresetn] \
  [get_bd_pins axi_register_slice_0/aresetn] [get_bd_pins axi_data_fifo_0/aresetn] [get_bd_pins axi_data_fifo_1/aresetn] \
  [get_bd_pins axi_data_fifo_2/aresetn] [get_bd_pins axi_data_fifo_3/aresetn] [get_bd_pins axi_data_fifo_4/aresetn] \
  [get_bd_pins axi_data_fifo_5/aresetn] [get_bd_pins axi_data_fifo_10/aresetn] [get_bd_pins axi_data_fifo_6/aresetn] \
  [get_bd_pins axi_data_fifo_7/aresetn] [get_bd_pins axi_data_fifo_8/aresetn] [get_bd_pins axi_data_fifo_9/aresetn] \
  [get_bd_pins gate_axi_0/aresetn] [get_bd_pins addrmonitor_0/aresetn] [get_bd_pins ila_0/probe5]
connect_bd_net [get_bd_pins rst_ddr4_0_300M_1/peripheral_aresetn] \
  [get_bd_pins undolog_0/m01_axi_aresetn] [get_bd_pins undolog_0/m02_axi_aresetn] [get_bd_pins undolog_0/s00_axi_aresetn] \
  [get_bd_pins undolog_0/m00_axi_aresetn] [get_bd_pins undolog_1/m01_axi_aresetn] [get_bd_pins undolog_1/m02_axi_aresetn] \
  [get_bd_pins undolog_1/s00_axi_aresetn] [get_bd_pins undolog_1/m00_axi_aresetn] [get_bd_pins undolog_2/s00_axi_aresetn] \
  [get_bd_pins undolog_3/s00_axi_aresetn] [get_bd_pins memops_scheduler_1/m00_axi_aresetn] \
  [get_bd_pins memops_scheduler_1/s00_axi_aresetn]
connect_bd_net [get_bd_pins rst_ddr4_0_300M/interconnect_aresetn] \
  [get_bd_pins axis_data_fifo_0/s_axis_aresetn] [get_bd_pins axis_data_fifo_1/s_axis_aresetn] \
  [get_bd_pins axis_data_fifo_2/s_axis_aresetn] [get_bd_pins axis_data_fifo_3/s_axis_aresetn]
connect_bd_net [get_bd_pins xlconstant_0/dout] \
  [get_bd_pins undolog_0/m01_axi_init_axi_txn] [get_bd_pins undolog_0/m02_axi_init_axi_txn] \
  [get_bd_pins undolog_0/m00_axi_init_axi_txn] [get_bd_pins undolog_1/m01_axi_init_axi_txn] \
  [get_bd_pins undolog_1/m02_axi_init_axi_txn] [get_bd_pins undolog_1/m00_axi_init_axi_txn] \
  [get_bd_pins undolog_2/m01_axi_init_axi_txn] [get_bd_pins undolog_2/m02_axi_init_axi_txn] \
  [get_bd_pins undolog_2/m00_axi_init_axi_txn] [get_bd_pins undolog_3/m01_axi_init_axi_txn] \
  [get_bd_pins undolog_3/m02_axi_init_axi_txn] [get_bd_pins undolog_3/m00_axi_init_axi_txn]
connect_bd_net [get_bd_pins axi_dma_0/m_axis_mm2s_tkeep] [get_bd_pins axis_data_fifo_0/s_axis_tkeep]
connect_bd_net [get_bd_pins axi_dma_0/m_axis_mm2s_tlast] [get_bd_pins axis_data_fifo_0/s_axis_tlast]
connect_bd_net [get_bd_pins axi_dma_0/m_axis_mm2s_tvalid] [get_bd_pins axis_data_fifo_0/s_axis_tvalid]
connect_bd_net [get_bd_pins axis_data_fifo_0/s_axis_tready] [get_bd_pins axi_dma_0/m_axis_mm2s_tready]
connect_bd_net [get_bd_pins xlconstant_1/dout] \
  [get_bd_pins axis_data_fifo_0/s_axis_tdata] [get_bd_pins axis_data_fifo_4/s_axis_tdata] \
  [get_bd_pins axis_data_fifo_6/s_axis_tdata]
connect_bd_net [get_bd_pins axi_dma_4/m_axis_mm2s_tkeep] [get_bd_pins axis_data_fifo_4/s_axis_tkeep]
connect_bd_net [get_bd_pins axi_dma_4/m_axis_mm2s_tlast] [get_bd_pins axis_data_fifo_4/s_axis_tlast]
connect_bd_net [get_bd_pins axis_data_fifo_4/s_axis_tready] [get_bd_pins axi_dma_4/m_axis_mm2s_tready]
connect_bd_net [get_bd_pins axi_dma_4/m_axis_mm2s_tvalid] [get_bd_pins axis_data_fifo_4/s_axis_tvalid]
connect_bd_net [get_bd_pins axi_dma_6/m_axis_mm2s_tvalid] [get_bd_pins axis_data_fifo_6/s_axis_tvalid]
connect_bd_net [get_bd_pins axis_data_fifo_6/s_axis_tready] [get_bd_pins axi_dma_6/m_axis_mm2s_tready]
connect_bd_net [get_bd_pins axi_dma_6/m_axis_mm2s_tkeep] [get_bd_pins axis_data_fifo_6/s_axis_tkeep]
connect_bd_net [get_bd_pins axi_dma_6/m_axis_mm2s_tlast] [get_bd_pins axis_data_fifo_6/s_axis_tlast]
connect_bd_net -net microblaze_0_Clk [get_bd_pins clk_wiz_0/clk_out1] \
  [get_bd_pins axi_dma_4/s_axi_lite_aclk] [get_bd_pins axi_dma_4/m_axi_mm2s_aclk] [get_bd_pins axi_dma_4/m_axi_s2mm_aclk] \
  [get_bd_pins axis_data_fifo_4/s_axis_aclk] [get_bd_pins axis_data_fifo_6/s_axis_aclk] \
  [get_bd_pins axi_dma_6/s_axi_lite_aclk] [get_bd_pins axi_dma_6/m_axi_mm2s_aclk] [get_bd_pins axi_dma_6/m_axi_s2mm_aclk] \
  [get_bd_pins axis_data_fifo_5/s_axis_aclk] [get_bd_pins axi_dma_5/s_axi_lite_aclk] [get_bd_pins axi_dma_5/m_axi_mm2s_aclk] \
  [get_bd_pins axi_dma_5/m_axi_s2mm_aclk] [get_bd_pins axis_data_fifo_7/s_axis_aclk] [get_bd_pins axi_dma_7/s_axi_lite_aclk] \
  [get_bd_pins axi_dma_7/m_axi_mm2s_aclk] [get_bd_pins axi_dma_7/m_axi_s2mm_aclk] [get_bd_pins smartconnect_0/aclk3] \
  [get_bd_pins axi_smc/aclk3] [get_bd_pins proc_sys_reset_0/slowest_sync_clk] [get_bd_pins undolog_2/m01_axi_aclk] \
  [get_bd_pins undolog_2/m02_axi_aclk] [get_bd_pins undolog_2/m00_axi_aclk] [get_bd_pins undolog_3/m01_axi_aclk] \
  [get_bd_pins undolog_3/m02_axi_aclk] [get_bd_pins undolog_3/m00_axi_aclk]
connect_bd_net [get_bd_pins proc_sys_reset_0/peripheral_aresetn] \
  [get_bd_pins axis_data_fifo_5/s_axis_aresetn] [get_bd_pins axis_data_fifo_7/s_axis_aresetn] \
  [get_bd_pins axis_data_fifo_6/s_axis_aresetn] [get_bd_pins axis_data_fifo_4/s_axis_aresetn] \
  [get_bd_pins axi_dma_5/axi_resetn] [get_bd_pins axi_dma_6/axi_resetn] [get_bd_pins axi_dma_4/axi_resetn] \
  [get_bd_pins undolog_2/m01_axi_aresetn] [get_bd_pins undolog_2/m02_axi_aresetn] [get_bd_pins undolog_2/m00_axi_aresetn] \
  [get_bd_pins undolog_3/m01_axi_aresetn] [get_bd_pins undolog_3/m02_axi_aresetn] [get_bd_pins undolog_3/m00_axi_aresetn]
connect_bd_net [get_bd_pins xdma_0/m_axib_awaddr] [get_bd_pins addrmonitor_0/s00_axi_awaddr]
connect_bd_net [get_bd_pins xdma_0/m_axib_awvalid] [get_bd_pins addrmonitor_0/s00_axi_awvalid]
connect_bd_net [get_bd_pins xdma_0/m_axib_wdata] [get_bd_pins addrmonitor_0/s00_axi_wdata]
connect_bd_net [get_bd_pins xdma_0/m_axib_wvalid] [get_bd_pins addrmonitor_0/s00_axi_wvalid]
connect_bd_net [get_bd_pins addrmonitor_0/pmem_obj_offset_valid] [get_bd_pins ila_0/probe6] [get_bd_pins memops_scheduler_1/offset_valid]
connect_bd_net [get_bd_pins addrmonitor_0/pmem_obj_offset] [get_bd_pins memops_scheduler_1/offset]
connect_bd_net [get_bd_pins mdm_1/Debug_SYS_Rst] [get_bd_pins proc_sys_reset_0/mb_debug_sys_rst]
connect_bd_net [get_bd_pins rst_ddr4_0_300M_2/peripheral_aresetn] \
  [get_bd_pins ddr4_0/c0_ddr4_aresetn] [get_bd_pins AXI_Lite_slave_plug_0/s00_axi_aresetn]
connect_bd_net -net memops_scheduler_0_ndp_not_inuse [get_bd_pins memops_scheduler_1/ndp_not_inuse] \
  [get_bd_pins gate_axi_0/ndp_not_inuse] [get_bd_pins ila_2/probe9]
connect_bd_net [get_bd_pins addrmonitor_0/m00_axi_wvalid] [get_bd_pins axi_register_slice_0/s_axi_wvalid]
connect_bd_net [get_bd_pins addrmonitor_0/m00_axi_awvalid] \
  [get_bd_pins axi_register_slice_0/s_axi_awvalid] [get_bd_pins memops_scheduler_1/axi_awvalid_in]
connect_bd_net [get_bd_pins addrmonitor_0/m00_axi_awaddr] \
  [get_bd_pins axi_register_slice_0/s_axi_awaddr] [get_bd_pins memops_scheduler_1/axi_awaddr_in]
connect_bd_net [get_bd_pins addrmonitor_0/m00_axi_wdata] [get_bd_pins axi_register_slice_0/s_axi_wdata]
connect_bd_net [get_bd_pins smartconnect_1/M00_AXI_awvalid] [get_bd_pins gate_axi_0/awvalid_in]
connect_bd_net [get_bd_pins gate_axi_0/awvalid_out] [get_bd_pins axi_smc/S00_AXI_awvalid]
connect_bd_net [get_bd_pins axi_smc/S00_AXI_awready] [get_bd_pins gate_axi_0/awready_in]
connect_bd_net [get_bd_pins gate_axi_0/awready_out] [get_bd_pins smartconnect_1/M00_AXI_awready]
connect_bd_net [get_bd_pins memops_scheduler_1/offset_read_addr] [get_bd_pins addrmonitor_0/readaddr]
connect_bd_net [get_bd_pins memops_scheduler_1/offset_read_enable] [get_bd_pins addrmonitor_0/readenable] [get_bd_pins ila_2/probe7]
connect_bd_net [get_bd_pins smartconnect_1/M00_AXI_arvalid] [get_bd_pins gate_axi_0/arvalid_in]
connect_bd_net [get_bd_pins gate_axi_0/arready_out] [get_bd_pins smartconnect_1/M00_AXI_arready]
connect_bd_net [get_bd_pins axi_smc/S00_AXI_arready] [get_bd_pins gate_axi_0/arready_in]
connect_bd_net [get_bd_pins gate_axi_0/arvalid_out] [get_bd_pins axi_smc/S00_AXI_arvalid]
connect_bd_net [get_bd_pins smartconnect_1/M00_AXI_wvalid] [get_bd_pins gate_axi_0/wvalid_in]
connect_bd_net [get_bd_pins gate_axi_0/wready_out] [get_bd_pins smartconnect_1/M00_AXI_wready]
connect_bd_net [get_bd_pins smartconnect_1/M00_AXI_bready] [get_bd_pins gate_axi_0/bready_in]
connect_bd_net [get_bd_pins gate_axi_0/bvalid_out] [get_bd_pins smartconnect_1/M00_AXI_bvalid]
connect_bd_net [get_bd_pins gate_axi_0/rvalid_out] [get_bd_pins smartconnect_1/M00_AXI_rvalid]
connect_bd_net [get_bd_pins smartconnect_1/M00_AXI_rready] [get_bd_pins gate_axi_0/rready_in]
connect_bd_net [get_bd_pins gate_axi_0/wvalid_out] [get_bd_pins axi_smc/S00_AXI_wvalid]
connect_bd_net [get_bd_pins axi_smc/S00_AXI_wready] [get_bd_pins gate_axi_0/wready_in]
connect_bd_net [get_bd_pins axi_smc/S00_AXI_bvalid] [get_bd_pins gate_axi_0/bvalid_in]
connect_bd_net [get_bd_pins gate_axi_0/bready_out] [get_bd_pins axi_smc/S00_AXI_bready]
connect_bd_net [get_bd_pins axi_smc/S00_AXI_rvalid] [get_bd_pins gate_axi_0/rvalid_in]
connect_bd_net [get_bd_pins gate_axi_0/rready_out] [get_bd_pins axi_smc/S00_AXI_rready]
connect_bd_net [get_bd_pins smartconnect_1/M00_AXI_awaddr] [get_bd_pins gate_axi_0/awaddr_in]
connect_bd_net [get_bd_pins gate_axi_0/awaddr_out] [get_bd_pins axi_smc/S00_AXI_awaddr]
connect_bd_net [get_bd_pins smartconnect_1/M00_AXI_awqos] [get_bd_pins axi_smc/S00_AXI_awqos]
connect_bd_net [get_bd_pins smartconnect_1/M00_AXI_wlast] [get_bd_pins axi_smc/S00_AXI_wlast]
connect_bd_net [get_bd_pins undolog_0/data_copy_pulse] [get_bd_pins ila_3/probe0]
connect_bd_net [get_bd_pins addrmonitor_0/state] [get_bd_pins ila_0/probe0]
connect_bd_net -net addrmonitor_0_virtualaddr [get_bd_pins addrmonitor_0/virtualaddr_out] [get_bd_pins ila_0/probe2]
connect_bd_net [get_bd_pins addrmonitor_0/offset] [get_bd_pins ila_0/probe3]
connect_bd_net [get_bd_pins addrmonitor_0/physicaladdr] [get_bd_pins ila_0/probe1]
connect_bd_net [get_bd_pins addrmonitor_0/count] [get_bd_pins ila_0/probe4]
connect_bd_net [get_bd_pins undolog_0/datacpy_done] [get_bd_pins ila_3/probe1]
connect_bd_net [get_bd_pins undolog_0/log_size] [get_bd_pins ila_3/probe2]
connect_bd_net [get_bd_pins undolog_0/log_src] [get_bd_pins ila_3/probe3]
connect_bd_net [get_bd_pins undolog_0/ulog_offset] [get_bd_pins ila_3/probe4]
connect_bd_net [get_bd_pins memops_scheduler_1/mst_exec_state] [get_bd_pins ila_2/probe2]
connect_bd_net [get_bd_pins undolog_0/regout] [get_bd_pins ila_3/probe5]
connect_bd_net [get_bd_pins memops_scheduler_1/ndp_start] [get_bd_pins ila_2/probe3]
connect_bd_net [get_bd_pins memops_scheduler_1/offset_reg1_valid] [get_bd_pins ila_2/probe4]
connect_bd_net [get_bd_pins memops_scheduler_1/offset_reg2_valid] [get_bd_pins ila_2/probe5]
connect_bd_net [get_bd_pins memops_scheduler_1/vaddr_offset_count] [get_bd_pins ila_2/probe6]
connect_bd_net [get_bd_pins memops_scheduler_1/ndp_done] [get_bd_pins ila_2/probe8]
connect_bd_net [get_bd_pins memops_scheduler_1/done_count] [get_bd_pins ila_2/probe0]
connect_bd_net [get_bd_pins memops_scheduler_1/start_count] [get_bd_pins ila_2/probe1]

# ---- address map ----
assign_bd_address -offset 0x00000000 -range 512M -target_address_space [get_bd_addr_spaces axi_dma_0/Data_MM2S] [get_bd_addr_segs xdma_0/S_AXI_LITE/CTL0]
assign_bd_address -offset 0x44A00000 -range 64K -target_address_space [get_bd_addr_spaces axi_dma_0/Data_MM2S] [get_bd_addr_segs AXI_Lite_slave_plug_0/S00_AXI/S00_AXI_reg]
assign_bd_address -offset 0x80000000 -range 2G -target_address_space [get_bd_addr_spaces axi_dma_0/Data_MM2S] [get_bd_addr_segs ddr4_0/C0_DDR4_MEMORY_MAP/C0_DDR4_ADDRESS_BLOCK]
assign_bd_address -offset 0x00000000 -range 512M -target_address_space [get_bd_addr_spaces axi_dma_0/Data_S2MM] [get_bd_addr_segs xdma_0/S_AXI_LITE/CTL0]
assign_bd_address -offset 0x44A00000 -range 64K -target_address_space [get_bd_addr_spaces axi_dma_0/Data_S2MM] [get_bd_addr_segs AXI_Lite_slave_plug_0/S00_AXI/S00_AXI_reg]
assign_bd_address -offset 0x80000000 -range 2G -target_address_space [get_bd_addr_spaces axi_dma_0/Data_S2MM] [get_bd_addr_segs ddr4_0/C0_DDR4_MEMORY_MAP/C0_DDR4_ADDRESS_BLOCK]
assign_bd_address -offset 0x00000000 -range 512M -target_address_space [get_bd_addr_spaces axi_dma_1/Data_MM2S] [get_bd_addr_segs xdma_0/S_AXI_LITE/CTL0]
assign_bd_address -offset 0x80000000 -range 2G -target_address_space [get_bd_addr_spaces axi_dma_1/Data_MM2S] [get_bd_addr_segs ddr4_0/C0_DDR4_MEMORY_MAP/C0_DDR4_ADDRESS_BLOCK]
exclude_bd_addr_seg -offset 0x44A00000 -range 64K -target_address_space [get_bd_addr_spaces axi_dma_1/Data_MM2S] [get_bd_addr_segs AXI_Lite_slave_plug_0/S00_AXI/S00_AXI_reg]
assign_bd_address -offset 0x00000000 -range 512M -target_address_space [get_bd_addr_spaces axi_dma_1/Data_S2MM] [get_bd_addr_segs xdma_0/S_AXI_LITE/CTL0]
assign_bd_address -offset 0x80000000 -range 2G -target_address_space [get_bd_addr_spaces axi_dma_1/Data_S2MM] [get_bd_addr_segs ddr4_0/C0_DDR4_MEMORY_MAP/C0_DDR4_ADDRESS_BLOCK]
exclude_bd_addr_seg -offset 0x44A00000 -range 64K -target_address_space [get_bd_addr_spaces axi_dma_1/Data_S2MM] [get_bd_addr_segs AXI_Lite_slave_plug_0/S00_AXI/S00_AXI_reg]
assign_bd_address -offset 0x00000000 -range 512M -target_address_space [get_bd_addr_spaces axi_dma_2/Data_MM2S] [get_bd_addr_segs xdma_0/S_AXI_LITE/CTL0]
assign_bd_address -offset 0x80000000 -range 2G -target_address_space [get_bd_addr_spaces axi_dma_2/Data_MM2S] [get_bd_addr_segs ddr4_0/C0_DDR4_MEMORY_MAP/C0_DDR4_ADDRESS_BLOCK]
exclude_bd_addr_seg -offset 0x44A00000 -range 64K -target_address_space [get_bd_addr_spaces axi_dma_2/Data_MM2S] [get_bd_addr_segs AXI_Lite_slave_plug_0/S00_AXI/S00_AXI_reg]
assign_bd_address -offset 0x00000000 -range 512M -target_address_space [get_bd_addr_spaces axi_dma_2/Data_S2MM] [get_bd_addr_segs xdma_0/S_AXI_LITE/CTL0]
assign_bd_address -offset 0x80000000 -range 2G -target_address_space [get_bd_addr_spaces axi_dma_2/Data_S2MM] [get_bd_addr_segs ddr4_0/C0_DDR4_MEMORY_MAP/C0_DDR4_ADDRESS_BLOCK]
exclude_bd_addr_seg -offset 0x44A00000 -range 64K -target_address_space [get_bd_addr_spaces axi_dma_2/Data_S2MM] [get_bd_addr_segs AXI_Lite_slave_plug_0/S00_AXI/S00_AXI_reg]
assign_bd_address -offset 0x00000000 -range 512M -target_address_space [get_bd_addr_spaces axi_dma_3/Data_MM2S] [get_bd_addr_segs xdma_0/S_AXI_LITE/CTL0]
assign_bd_address -offset 0x80000000 -range 2G -target_address_space [get_bd_addr_spaces axi_dma_3/Data_MM2S] [get_bd_addr_segs ddr4_0/C0_DDR4_MEMORY_MAP/C0_DDR4_ADDRESS_BLOCK]
exclude_bd_addr_seg -offset 0x44A00000 -range 64K -target_address_space [get_bd_addr_spaces axi_dma_3/Data_MM2S] [get_bd_addr_segs AXI_Lite_slave_plug_0/S00_AXI/S00_AXI_reg]
assign_bd_address -offset 0x00000000 -range 512M -target_address_space [get_bd_addr_spaces axi_dma_3/Data_S2MM] [get_bd_addr_segs xdma_0/S_AXI_LITE/CTL0]
assign_bd_address -offset 0x80000000 -range 2G -target_address_space [get_bd_addr_spaces axi_dma_3/Data_S2MM] [get_bd_addr_segs ddr4_0/C0_DDR4_MEMORY_MAP/C0_DDR4_ADDRESS_BLOCK]
exclude_bd_addr_seg -offset 0x44A00000 -range 64K -target_address_space [get_bd_addr_spaces axi_dma_3/Data_S2MM] [get_bd_addr_segs AXI_Lite_slave_plug_0/S00_AXI/S00_AXI_reg]
assign_bd_address -offset 0x00000000 -range 512M -target_address_space [get_bd_addr_spaces axi_dma_4/Data_MM2S] [get_bd_addr_segs xdma_0/S_AXI_LITE/CTL0]
assign_bd_address -offset 0x80000000 -range 2G -target_address_space [get_bd_addr_spaces axi_dma_4/Data_MM2S] [get_bd_addr_segs ddr4_0/C0_DDR4_MEMORY_MAP/C0_DDR4_ADDRESS_BLOCK]
exclude_bd_addr_seg -offset 0x44A00000 -range 64K -target_address_space [get_bd_addr_spaces axi_dma_4/Data_MM2S] [get_bd_addr_segs AXI_Lite_slave_plug_0/S00_AXI/S00_AXI_reg]
assign_bd_address -offset 0x00000000 -range 512M -target_address_space [get_bd_addr_spaces axi_dma_4/Data_S2MM] [get_bd_addr_segs xdma_0/S_AXI_LITE/CTL0]
assign_bd_address -offset 0x80000000 -range 2G -target_address_space [get_bd_addr_spaces axi_dma_4/Data_S2MM] [get_bd_addr_segs ddr4_0/C0_DDR4_MEMORY_MAP/C0_DDR4_ADDRESS_BLOCK]
exclude_bd_addr_seg -offset 0x44A00000 -range 64K -target_address_space [get_bd_addr_spaces axi_dma_4/Data_S2MM] [get_bd_addr_segs AXI_Lite_slave_plug_0/S00_AXI/S00_AXI_reg]
assign_bd_address -offset 0x00000000 -range 512M -target_address_space [get_bd_addr_spaces axi_dma_5/Data_MM2S] [get_bd_addr_segs xdma_0/S_AXI_LITE/CTL0]
assign_bd_address -offset 0x80000000 -range 2G -target_address_space [get_bd_addr_spaces axi_dma_5/Data_MM2S] [get_bd_addr_segs ddr4_0/C0_DDR4_MEMORY_MAP/C0_DDR4_ADDRESS_BLOCK]
exclude_bd_addr_seg -offset 0x44A00000 -range 64K -target_address_space [get_bd_addr_spaces axi_dma_5/Data_MM2S] [get_bd_addr_segs AXI_Lite_slave_plug_0/S00_AXI/S00_AXI_reg]
assign_bd_address -offset 0x00000000 -range 512M -target_address_space [get_bd_addr_spaces axi_dma_5/Data_S2MM] [get_bd_addr_segs xdma_0/S_AXI_LITE/CTL0]
assign_bd_address -offset 0x80000000 -range 2G -target_address_space [get_bd_addr_spaces axi_dma_5/Data_S2MM] [get_bd_addr_segs ddr4_0/C0_DDR4_MEMORY_MAP/C0_DDR4_ADDRESS_BLOCK]
exclude_bd_addr_seg -offset 0x44A00000 -range 64K -target_address_space [get_bd_addr_spaces axi_dma_5/Data_S2MM] [get_bd_addr_segs AXI_Lite_slave_plug_0/S00_AXI/S00_AXI_reg]
assign_bd_address -offset 0x00000000 -range 512M -target_address_space [get_bd_addr_spaces axi_dma_6/Data_MM2S] [get_bd_addr_segs xdma_0/S_AXI_LITE/CTL0]
assign_bd_address -offset 0x80000000 -range 2G -target_address_space [get_bd_addr_spaces axi_dma_6/Data_MM2S] [get_bd_addr_segs ddr4_0/C0_DDR4_MEMORY_MAP/C0_DDR4_ADDRESS_BLOCK]
exclude_bd_addr_seg -offset 0x44A00000 -range 64K -target_address_space [get_bd_addr_spaces axi_dma_6/Data_MM2S] [get_bd_addr_segs AXI_Lite_slave_plug_0/S00_AXI/S00_AXI_reg]
assign_bd_address -offset 0x00000000 -range 512M -target_address_space [get_bd_addr_spaces axi_dma_6/Data_S2MM] [get_bd_addr_segs xdma_0/S_AXI_LITE/CTL0]
assign_bd_address -offset 0x80000000 -range 2G -target_address_space [get_bd_addr_spaces axi_dma_6/Data_S2MM] [get_bd_addr_segs ddr4_0/C0_DDR4_MEMORY_MAP/C0_DDR4_ADDRESS_BLOCK]
exclude_bd_addr_seg -offset 0x44A00000 -range 64K -target_address_space [get_bd_addr_spaces axi_dma_6/Data_S2MM] [get_bd_addr_segs AXI_Lite_slave_plug_0/S00_AXI/S00_AXI_reg]
assign_bd_address -offset 0x00000000 -range 512M -target_address_space [get_bd_addr_spaces axi_dma_7/Data_MM2S] [get_bd_addr_segs xdma_0/S_AXI_LITE/CTL0]
assign_bd_address -offset 0x80000000 -range 2G -target_address_space [get_bd_addr_spaces axi_dma_7/Data_MM2S] [get_bd_addr_segs ddr4_0/C0_DDR4_MEMORY_MAP/C0_DDR4_ADDRESS_BLOCK]
exclude_bd_addr_seg -offset 0x44A00000 -range 64K -target_address_space [get_bd_addr_spaces axi_dma_7/Data_MM2S] [get_bd_addr_segs AXI_Lite_slave_plug_0/S00_AXI/S00_AXI_reg]
assign_bd_address -offset 0x00000000 -range 512M -target_address_space [get_bd_addr_spaces axi_dma_7/Data_S2MM] [get_bd_addr_segs xdma_0/S_AXI_LITE/CTL0]
assign_bd_address -offset 0x80000000 -range 2G -target_address_space [get_bd_addr_spaces axi_dma_7/Data_S2MM] [get_bd_addr_segs ddr4_0/C0_DDR4_MEMORY_MAP/C0_DDR4_ADDRESS_BLOCK]
exclude_bd_addr_seg -offset 0x44A00000 -range 64K -target_address_space [get_bd_addr_spaces axi_dma_7/Data_S2MM] [get_bd_addr_segs AXI_Lite_slave_plug_0/S00_AXI/S00_AXI_reg]
assign_bd_address -offset 0x40000000 -range 64K -target_address_space [get_bd_addr_spaces memops_scheduler_1/M00_AXI] [get_bd_addr_segs undolog_0/S00_AXI/S00_AXI_reg]
assign_bd_address -offset 0x40000000 -range 64K -target_address_space [get_bd_addr_spaces memops_scheduler_1/M01_AXI] [get_bd_addr_segs undolog_1/S00_AXI/S00_AXI_reg]
assign_bd_address -offset 0x40000000 -range 64K -target_address_space [get_bd_addr_spaces memops_scheduler_1/M02_AXI] [get_bd_addr_segs undolog_2/S00_AXI/S00_AXI_reg]
assign_bd_address -offset 0x40000000 -range 64K -target_address_space [get_bd_addr_spaces memops_scheduler_1/M03_AXI] [get_bd_addr_segs undolog_3/S00_AXI/S00_AXI_reg]
assign_bd_address -offset 0x40000000 -range 64K -target_address_space [get_bd_addr_spaces undolog_0/M00_AXI] [get_bd_addr_segs axi_dma_0/S_AXI_LITE/Reg]
assign_bd_address -offset 0x40000000 -range 64K -target_address_space [get_bd_addr_spaces undolog_0/M01_AXI] [get_bd_addr_segs axi_dma_1/S_AXI_LITE/Reg]
assign_bd_address -offset 0x00000000 -range 512M -target_address_space [get_bd_addr_spaces undolog_0/M02_AXI] [get_bd_addr_segs xdma_0/S_AXI_LITE/CTL0]
assign_bd_address -offset 0x44A00000 -range 64K -target_address_space [get_bd_addr_spaces undolog_0/M02_AXI] [get_bd_addr_segs AXI_Lite_slave_plug_0/S00_AXI/S00_AXI_reg]
assign_bd_address -offset 0x80000000 -range 2G -target_address_space [get_bd_addr_spaces undolog_0/M02_AXI] [get_bd_addr_segs ddr4_0/C0_DDR4_MEMORY_MAP/C0_DDR4_ADDRESS_BLOCK]
assign_bd_address -offset 0x40000000 -range 64K -target_address_space [get_bd_addr_spaces undolog_1/M00_AXI] [get_bd_addr_segs axi_dma_3/S_AXI_LITE/Reg]
assign_bd_address -offset 0x40000000 -range 64K -target_address_space [get_bd_addr_spaces undolog_1/M01_AXI] [get_bd_addr_segs axi_dma_2/S_AXI_LITE/Reg]
assign_bd_address -offset 0x00000000 -range 512M -target_address_space [get_bd_addr_spaces undolog_1/M02_AXI] [get_bd_addr_segs xdma_0/S_AXI_LITE/CTL0]
assign_bd_address -offset 0x44A00000 -range 64K -target_address_space [get_bd_addr_spaces undolog_1/M02_AXI] [get_bd_addr_segs AXI_Lite_slave_plug_0/S00_AXI/S00_AXI_reg]
assign_bd_address -offset 0x80000000 -range 2G -target_address_space [get_bd_addr_spaces undolog_1/M02_AXI] [get_bd_addr_segs ddr4_0/C0_DDR4_MEMORY_MAP/C0_DDR4_ADDRESS_BLOCK]
assign_bd_address -offset 0x40000000 -range 64K -target_address_space [get_bd_addr_spaces undolog_2/M00_AXI] [get_bd_addr_segs axi_dma_4/S_AXI_LITE/Reg]
assign_bd_address -offset 0x40000000 -range 64K -target_address_space [get_bd_addr_spaces undolog_2/M01_AXI] [get_bd_addr_segs axi_dma_5/S_AXI_LITE/Reg]
assign_bd_address -offset 0x00000000 -range 512M -target_address_space [get_bd_addr_spaces undolog_2/M02_AXI] [get_bd_addr_segs xdma_0/S_AXI_LITE/CTL0]
assign_bd_address -offset 0x44A00000 -range 64K -target_address_space [get_bd_addr_spaces undolog_2/M02_AXI] [get_bd_addr_segs AXI_Lite_slave_plug_0/S00_AXI/S00_AXI_reg]
assign_bd_address -offset 0x80000000 -range 2G -target_address_space [get_bd_addr_spaces undolog_2/M02_AXI] [get_bd_addr_segs ddr4_0/C0_DDR4_MEMORY_MAP/C0_DDR4_ADDRESS_BLOCK]
assign_bd_address -offset 0x40000000 -range 64K -target_address_space [get_bd_addr_spaces undolog_3/M00_AXI] [get_bd_addr_segs axi_dma_6/S_AXI_LITE/Reg]
assign_bd_address -offset 0x40000000 -range 64K -target_address_space [get_bd_addr_spaces undolog_3/M01_AXI] [get_bd_addr_segs axi_dma_7/S_AXI_LITE/Reg]
assign_bd_address -offset 0x00000000 -range 512M -target_address_space [get_bd_addr_spaces undolog_3/M02_AXI] [get_bd_addr_segs xdma_0/S_AXI_LITE/CTL0]
assign_bd_address -offset 0x44A00000 -range 64K -target_address_space [get_bd_addr_spaces undolog_3/M02_AXI] [get_bd_addr_segs AXI_Lite_slave_plug_0/S00_AXI/S00_AXI_reg]
assign_bd_address -offset 0x80000000 -range 2G -target_address_space [get_bd_addr_spaces undolog_3/M02_AXI] [get_bd_addr_segs ddr4_0/C0_DDR4_MEMORY_MAP/C0_DDR4_ADDRESS_BLOCK]
assign_bd_address -offset 0x00000000 -range 512M -target_address_space [get_bd_addr_spaces xdma_0/M_AXI_B] [get_bd_addr_segs xdma_0/S_AXI_LITE/CTL0]
assign_bd_address -offset 0x44A00000 -range 64K -target_address_space [get_bd_addr_spaces xdma_0/M_AXI_B] [get_bd_addr_segs AXI_Lite_slave_plug_0/S00_AXI/S00_AXI_reg]
assign_bd_address -offset 0x44A10000 -range 64K -target_address_space [get_bd_addr_spaces xdma_0/M_AXI_B] [get_bd_addr_segs memops_scheduler_1/S00_AXI/S00_AXI_reg]
assign_bd_address -offset 0x80000000 -range 2G -target_address_space [get_bd_addr_spaces xdma_0/M_AXI_B] [get_bd_addr_segs ddr4_0/C0_DDR4_MEMORY_MAP/C0_DDR4_ADDRESS_BLOCK]

validate_bd_design
save_bd_design
